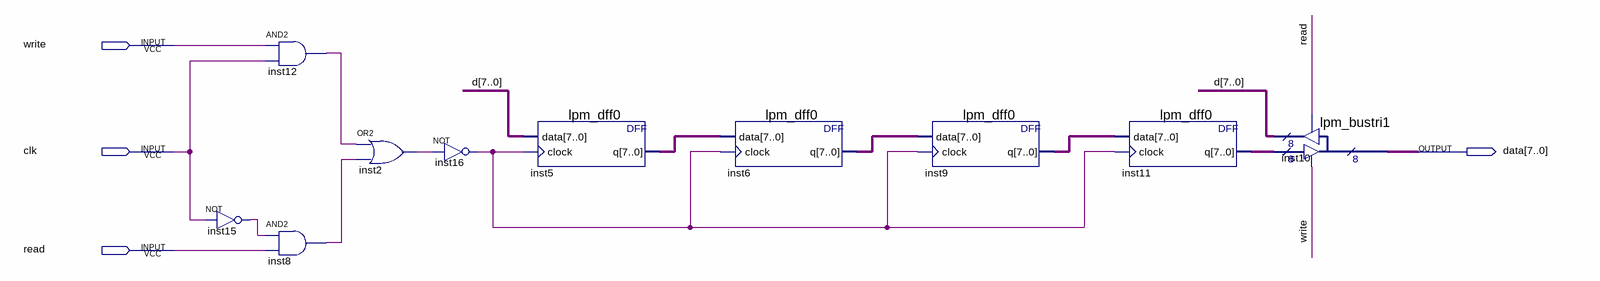
[diagram p0: schematic sheet]
// Quartus schematic lab3BUFFER.bdf as structural Verilog: 10 symbols, 4 pins
module lab3BUFFER (
  input  write,
  input  clk,
  input  read,
  output [7:0] data
);

  wire inst2_out, inst8_out, inst12_out, inst15_out, inst16_out;
  wire [7:0] d, inst5_q, inst6_q, inst9_q, inst11_q;

  not inst15 (inst15_out, clk);
  and inst12 (inst12_out, write, clk);
  and inst8 (inst8_out, inst15_out, read);
  or inst2 (inst2_out, inst12_out, inst8_out);
  not inst16 (inst16_out, inst2_out);
  lpm_dff0 inst5 (.data(d), .clock(inst16_out), .q(inst5_q));
  lpm_dff0 inst6 (.data(inst5_q), .clock(inst16_out), .q(inst6_q));
  lpm_dff0 inst9 (.data(inst6_q), .clock(inst16_out), .q(inst9_q));
  lpm_dff0 inst11 (.data(inst9_q), .clock(inst16_out), .q(inst11_q));
  lpm_bustri1 inst10 (.enabledt(write), .data(inst11_q), .enabletr(read), .result(d), .tridata(data));
endmodule
